# EAGLE schematic dew-heater (EAGLE 7.1.0)
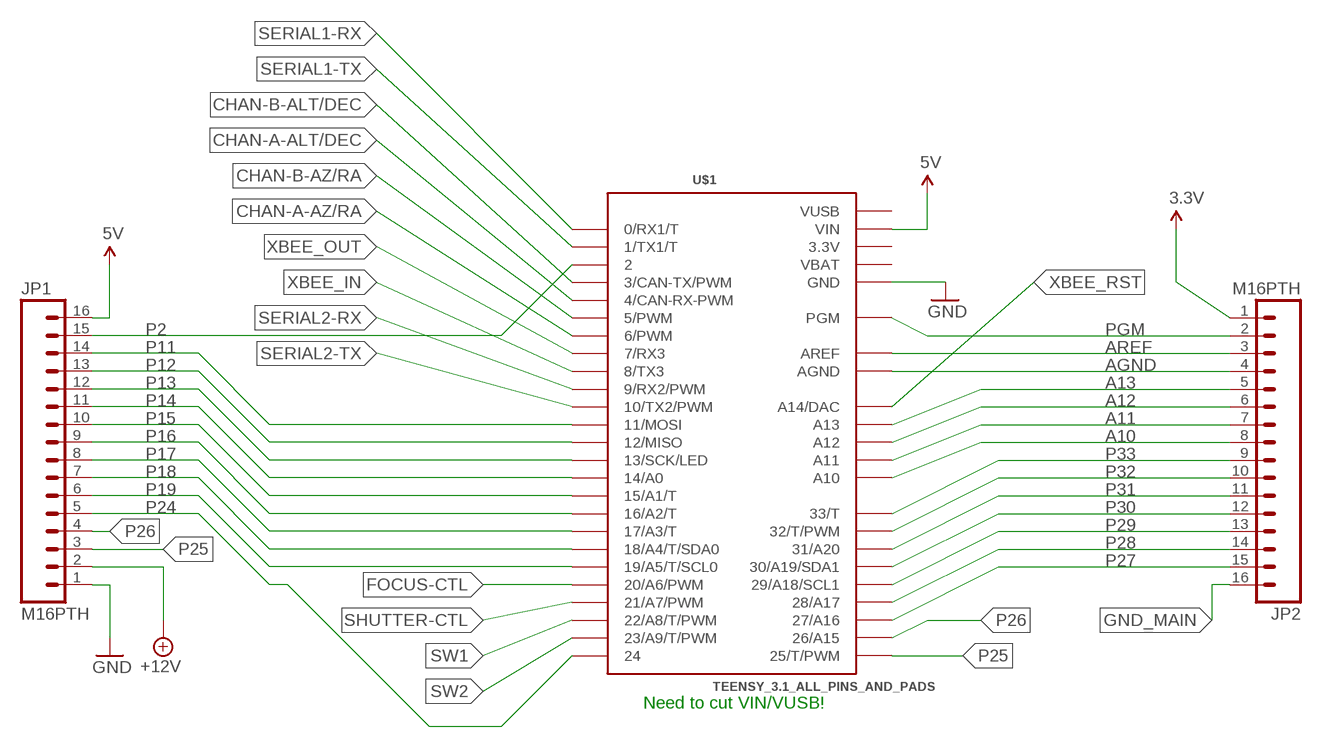
[diagram p0: schematic, sheet 1]

## Parts
JP1  M16PTH  [1X16]
JP2  M16PTH  [1X16]
U$1  TEENSY_3.1_ALL_PINS_AND_PADS  [TEENSY_3.1_ALLPINS]

## Nets
3.3V [5V]: JP2.1
5V [5V]: JP1.16 U$1.VIN
+12V [12V]: JP1.2
A10: JP2.8 U$1.A10
A11: JP2.7 U$1.A11
A12: JP2.6 U$1.A12
A13: JP2.5 U$1.A13
AGND: JP2.4 U$1.AGND
AREF: JP2.3 U$1.AREF
CHAN-A-ALT/DEC: U$1.4(4/CAN-RX-PWM)
CHAN-A-AZ/RA: U$1.6(6/PWM)
CHAN-B-ALT/DEC: U$1.3(3/CAN-TX/PWM)
CHAN-B-AZ/RA: U$1.5(5/PWM)
FOCUS-CTL: U$1.20/A6(20/A6/PWM)
GND [GND]: JP1.1 U$1.GND U$1.GND1(GND) U$1.GND2(GND)
GND_MAIN [GND]: JP2.16
P2: JP1.15 U$1.2
P11: JP1.14 U$1.11(11/MOSI)
P12: JP1.13 U$1.12(12/MISO)
P13: JP1.12 U$1.13(13/SCK/LED)
P14: JP1.11 U$1.14/A0
P15: JP1.10 U$1.15/A1(15/A1/T)
P16: JP1.9 U$1.16/A2(16/A2/T)
P17: JP1.8 U$1.17/A3(17/A3/T)
P18: JP1.7 U$1.18/A4(18/A4/T/SDA0)
P19: JP1.6 U$1.19/A5(19/A5/T/SCL0)
P24: JP1.5 U$1.24
P25: JP1.3 U$1.25(25/T/PWM)
P26: JP1.4 U$1.26(26/A15)
P27: JP2.15 U$1.27(27/A16)
P28: JP2.14 U$1.28(28/A17)
P29: JP2.13 U$1.29(29/A18/SCL1)
P30: JP2.12 U$1.30(30/A19/SDA1)
P31: JP2.11 U$1.31(31/A20)
P32: JP2.10 U$1.32(32/T/PWM)
P33: JP2.9 U$1.33(33/T)
PGM: JP2.2 U$1.PGM
SERIAL1-RX: U$1.0(0/RX1/T)
SERIAL1-TX: U$1.1(1/TX1/T)
SERIAL2-RX: U$1.9(9/RX2/PWM)
SERIAL2-TX: U$1.10(10/TX2/PWM)
SHUTTER-CTL: U$1.21/A7(21/A7/PWM)
SW1: U$1.22/A8(22/A8/T/PWM)
SW2: U$1.23/A9(23/A9/T/PWM)
XBEE_IN: U$1.8(8/TX3)
XBEE_OUT: U$1.7(7/RX3)
XBEE_RST: U$1.A14(A14/DAC)

## Notes on the sheet
- Need to cut VIN/VUSB!

## Power pins joined to a net without a drawn wire
3.3V: U$1.3.3V U$1.3.3V1(3.3V) U$1.3.3V2(3.3V)
VBAT: U$1.VBAT
VUSB: U$1.VUSB

## Library data of the parts
JP1 JP2 = SparkFun-Connectors:M16: 1x16 .1" header
U$1 = Teensy_3_Series_Board_v1.0:TEENSY_3.1_ALL_PINS_AND_PADS: Footprint for Teensy 3.1 board using all pads and all through-holes. Pads need a 2x7 0.1" SMD header.

## Net classes
0 default: width 0.152 mm
1 5V: width 0.254 mm, clearance 0.127 mm
2 GND: width 0.254 mm, clearance 0.127 mm
3 12V: width 0.254 mm, clearance 0.127 mm